# Altium project NICA_FEE.PrjPcb
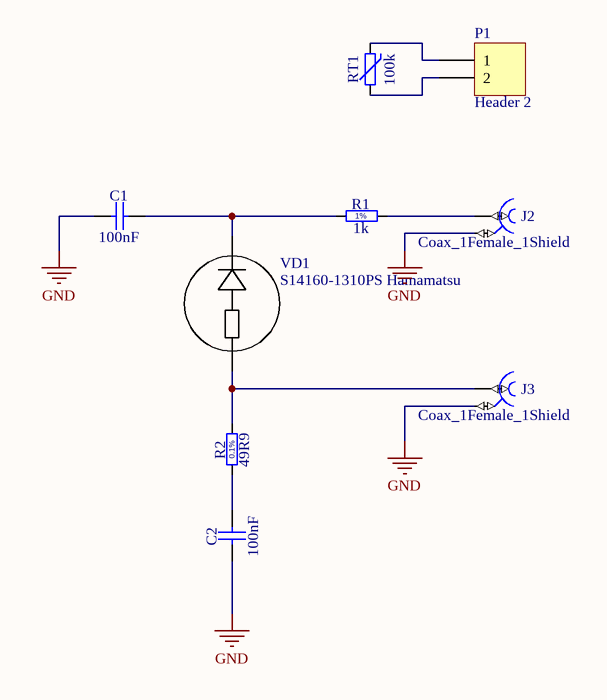
[diagram p0: main.SchDoc]
1 sheet, 9 parts. Net scope: global (net labels, ports and power ports of the same name join across sheets).
Board file: NICA_FEE.PcbDoc

## Sheet main.SchDoc
size A4

### Parts
C1  100nF  [CAPC1608X90N]
C2  100nF  [CAPC1608X90N]
J2  Coax_1Female_1Shield  [HUBER-SUHNER_85_MMCX-50-0-1/111_OE]
J3  Coax_1Female_1Shield  [HUBER-SUHNER_85_MMCX-50-0-1/111_OE]
P1  Header 2  [HDR1X2]
R1  1k  [RESC1608X55N]
R2  49R9  [RESC1608X55N]
RT1  100k  [THERMC1608X90N]
VD1  S14160-1310PS Hamamatsu  [S14160-1310PS]

### Nets
GND: C1.1 C2.1 J2.2 J3.2
NetC1_2: C1.2 R1.1 VD1.2(C)
NetC2_2: C2.2 R2.1
NetJ2_1: J2.1 R1.2
NetJ3_1: J3.1 R2.2 VD1.3(A)
NetP1_1: P1.1 RT1.2
NetP1_2: P1.2 RT1.1

### Notes on the sheet
- (in symbol R0603_1K_1%_0.1W_100PPM) 1%
- (in symbol R0603_49R9_0.1%_0.063W_10PPM) 0.1%

### Library data of the parts
C1 C2 = CC0603_100NF_100V_10%_X7R: Non-polarised capacitor; Part Description: SMD Multilayer Chip Ceramic Capacitor; Manufacturer: GENERIC; Manufacturer1 Part Number: GRM188R72A104KA35D; Voltage: 100V; TC: X7R; Tolerance: ±10%; Part Number: CC0603_100NF_100V_10%_X7R; Component Kind: Standard; Component Type: Standard; Pin Count: 2; Value: 100nF; Status: None; Manufacturer Part Number: CC0603_100NF_100V_10%_X7R; Case: 0603; Mounted: Yes; Socket: No; SMD: Yes; Sense: No; Manufacturer1 Example: MURATA; Manufacturer1 ComponentHeight: 0.9mm; HelpURL: \\cern.ch\dfs\Applications\Altium\Datasheets\CC0603_MURATA_GRM188R72A104KA35D.pdf; Author: CERN DEM JLC; CreateDate: 11.12.2013; LatestRevisionDate: 11.12.2013
J2 J3 = HUBER-SUHNER_85_MMCX-50-0-1/111_OE: Part Description: MMCX 50 Ohms Right Angle PCB Jack; Manufacturer: HUBER+SUHNER; PressFit: No; Part Number: HUBER-SUHNER_85_MMCX-50-0-1/111_OE; Component Kind: Standard; Component Type: Standard; Pin Count: 2; Family: MMCX; Mounted: Yes; Socket: No; SMD: No; Sense: No; Status: None; Manufacturer Part Number: 85_MMCX-50-0-1/111_OE; ComponentHeight: 9.6mm; HelpURL: \\cern.ch\dfs\Applications\Altium\Datasheets\HUBER-SUHNER_85_MMCX-50-0-1-111_OE.pdf; Author: CERN DEM JLC; CreateDate: 06.11.2014; LatestRevisionDate: 06.11.2014
P1 = Header 2: Header, 2-Pin; LatestRevisionDate: 17-Jul-2002; LatestRevisionNote: Re-released for DXP Platform.; Publisher: Altium Limited
R1 = R0603_1K_1%_0.1W_100PPM: Resistor - 1%; Part Description: General Purpose Thick Film Chip Resistor; Manufacturer: GENERIC; Manufacturer1 Part Number: NRC06F1001TRF; Power: 0.1W; TC: ±100ppm/°C; PressFit: No; Part Number: R0603_1K_1%_0.1W_100PPM; Component Kind: Standard; Component Type: Standard; Pin Count: 2; Value: 1k; Status: Preferred; Tolerance: ±1%; Manufacturer Part Number: R0603_1K_1%_0.1W_100PPM; Case: 0603; Mounted: Yes; Sense: No; Socket: No; SMD: Yes; Manufacturer1 Example: NIC COMPONENT; Manufacturer1 ComponentHeight: 0.55mm; HelpURL: \\cern.ch\dfs\Applications\Altium\Datasheets\R0603_NIC_NRC.pdf; Author: CERN DEM JLC; CreateDate: 03.12.2007; LatestRevisionDate: 13.03.2008
R2 = R0603_49R9_0.1%_0.063W_10PPM: Resistor - 0.1%; Part Description: Thin Film Chip Resistor; Manufacturer: GENERIC; Manufacturer1 Part Number: RN73C1J49R9BTDF; Power: 0.063W; TC: ±10ppm; PressFit: No; Part Number: R0603_49R9_0.1%_0.063W_10PPM; Component Kind: Standard; Component Type: Standard; Pin Count: 2; Value: 49R9; Status: Not Recommended; Tolerance: ±0.1%; Manufacturer Part Number: R0603_49R9_0.1%_0.063W_10PPM; Case: 0603; Mounted: Yes; Sense: No; Socket: No; SMD: Yes; Manufacturer1 Example: TYCO HOLSWORTHY; Manufacturer1 ComponentHeight: 0.5mm; HelpURL: \\cern.ch\dfs\Applications\Altium\Datasheets\R0603_Tyco_RN73.pdf; Author: CERN DEM JLC; CreateDate: 03.12.2007; LatestRevisionDate: 13.03.2008
RT1 = THERM_NTC_10K_EPCOS_B57330V2103J260: Thermistor NTC (Negative Temperature Coefficient); Part Description: SMD NTC Thermistor for Temperature Measurement; Manufacturer: EPCOS; Power: 180mW; Tolerance: ±5%; Part Number: THERM_NTC_10K_EPCOS_B57330V2103J260; Component Kind: Standard; Component Type: Standard; Pin Count: 2; Value: 100k; Status: None; Manufacturer Part Number: B57330V2103J260; Case: 0603; Mounted: Yes; Socket: No; SMD: Yes; Sense: No; ComponentHeight: 0.9mm; HelpURL: \\cern.ch\dfs\Applications\Altium\Datasheets\THERM_EPCOS_B573xxV2.pdf; Author: CERN DEM BC; CreateDate: 30.07.2015; LatestRevisionDate: 30.07.2015
VD1 = S14160-1310PS: Name: S14160-1310PS; Manufacturer: Hamamatsu